# EAGLE schematic XOR gate (EAGLE 6.5.0)
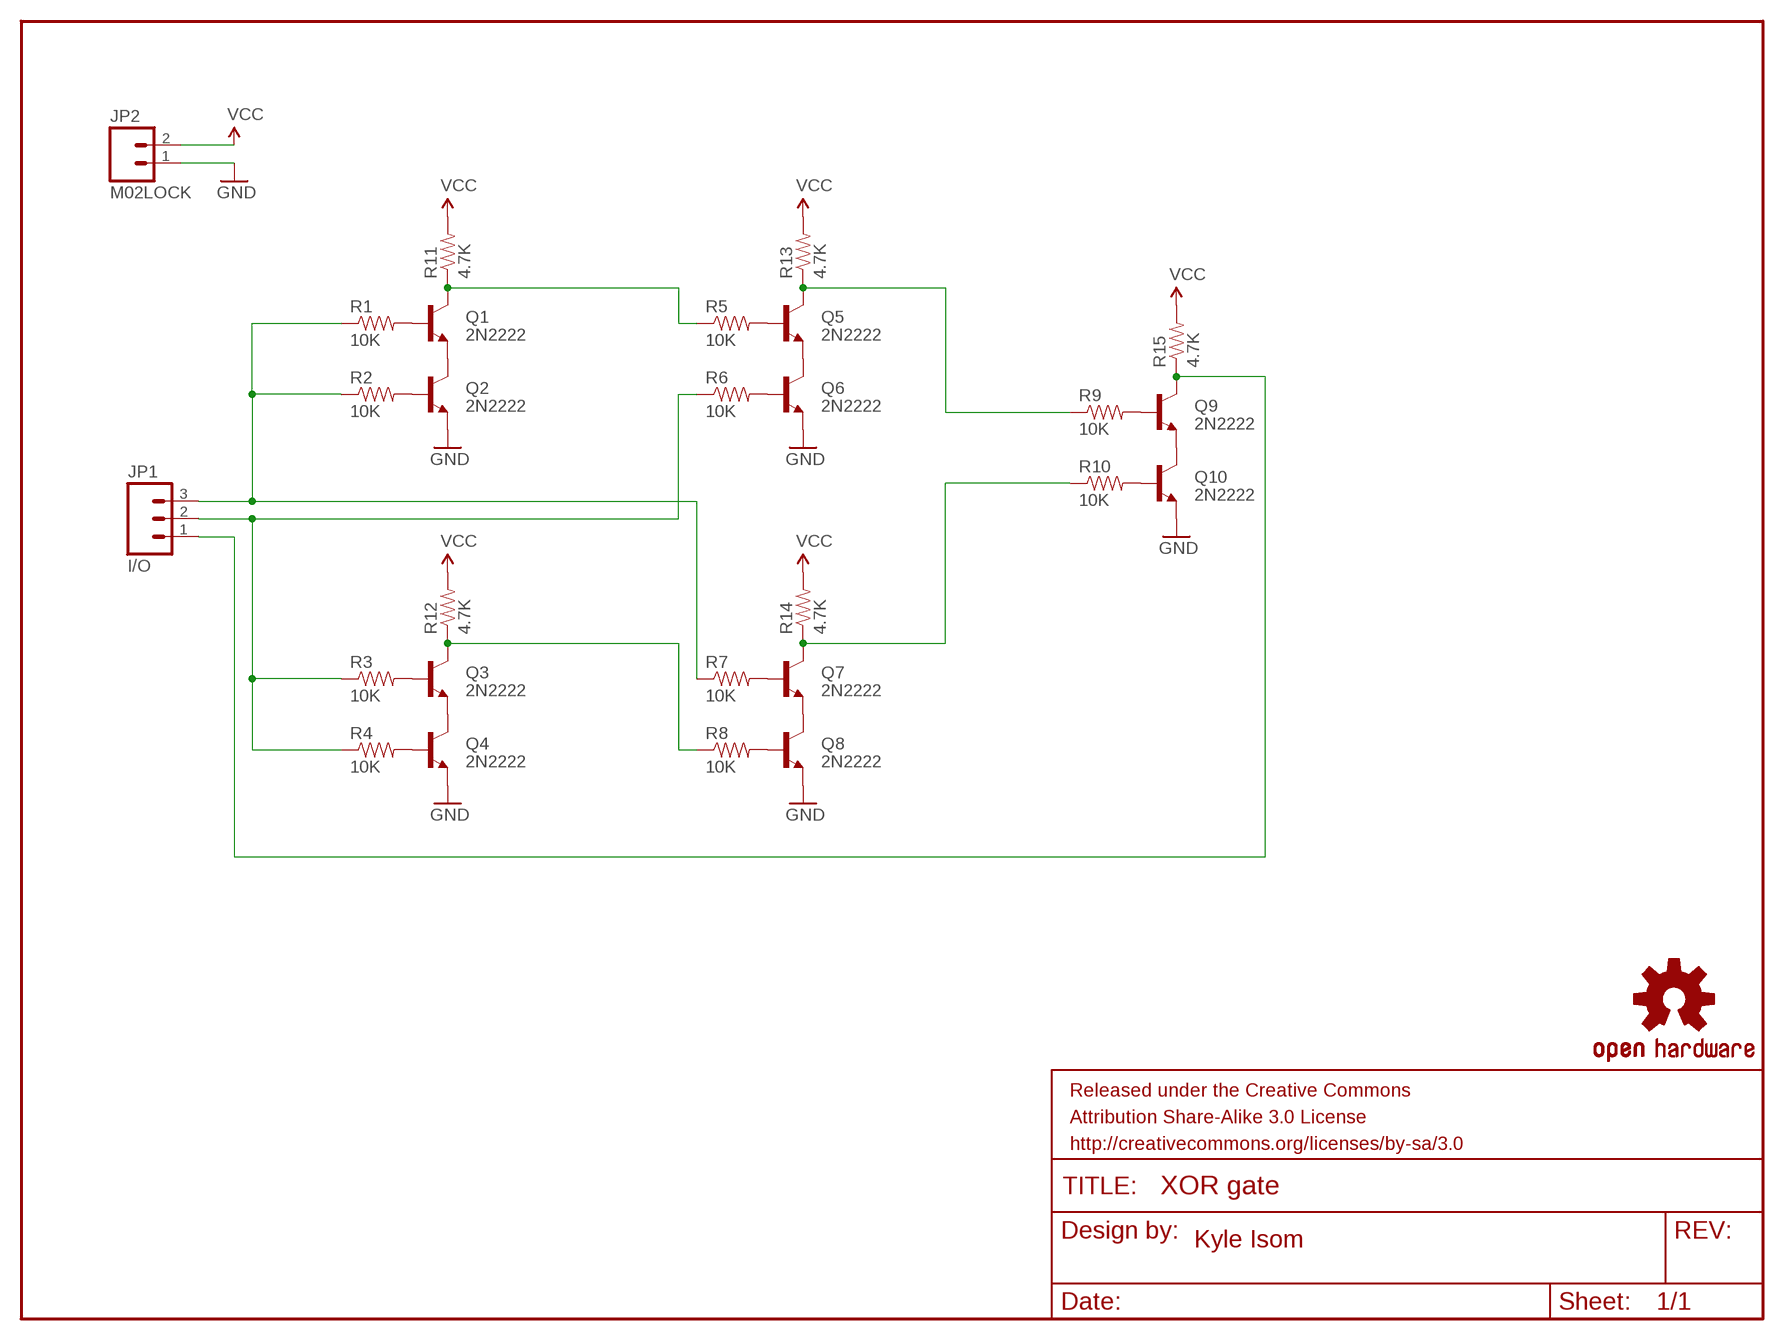
[diagram p0: schematic, sheet 1]

## Parts
FRAME1  FRAME-LETTER  [CREATIVE_COMMONS]
JP1  I/O  M03LOCK  [1X03_LOCK]
JP2  M02LOCK  [1X02_LOCK]
LOGO1  OSHW-LOGOS  [OSHW-LOGO-S]
Q1  2N2222  TRANSISTOR_NPNTO-92-AMMO  [TO-92-AMMO]
Q2  2N2222  TRANSISTOR_NPNTO-92-AMMO  [TO-92-AMMO]
Q3  2N2222  TRANSISTOR_NPNTO-92-AMMO  [TO-92-AMMO]
Q4  2N2222  TRANSISTOR_NPNTO-92-AMMO  [TO-92-AMMO]
Q5  2N2222  TRANSISTOR_NPNTO-92-AMMO  [TO-92-AMMO]
Q6  2N2222  TRANSISTOR_NPNTO-92-AMMO  [TO-92-AMMO]
Q7  2N2222  TRANSISTOR_NPNTO-92-AMMO  [TO-92-AMMO]
Q8  2N2222  TRANSISTOR_NPNTO-92-AMMO  [TO-92-AMMO]
Q9  2N2222  TRANSISTOR_NPNTO-92-AMMO  [TO-92-AMMO]
Q10  2N2222  TRANSISTOR_NPNTO-92-AMMO  [TO-92-AMMO]
R1  10K  RESISTORPTH-1/4W  [AXIAL-0.4]
R2  10K  RESISTORPTH-1/4W  [AXIAL-0.4]
R3  10K  RESISTORPTH-1/4W  [AXIAL-0.4]
R4  10K  RESISTORPTH-1/4W  [AXIAL-0.4]
R5  10K  RESISTORPTH-1/4W  [AXIAL-0.4]
R6  10K  RESISTORPTH-1/4W  [AXIAL-0.4]
R7  10K  RESISTORPTH-1/4W  [AXIAL-0.4]
R8  10K  RESISTORPTH-1/4W  [AXIAL-0.4]
R9  10K  RESISTORPTH-1/4W  [AXIAL-0.4]
R10  10K  RESISTORPTH-1/4W  [AXIAL-0.4]
R11  4.7K  RESISTORPTH-1/4W  [AXIAL-0.4]
R12  4.7K  RESISTORPTH-1/4W  [AXIAL-0.4]
R13  4.7K  RESISTORPTH-1/4W  [AXIAL-0.4]
R14  4.7K  RESISTORPTH-1/4W  [AXIAL-0.4]
R15  4.7K  RESISTORPTH-1/4W  [AXIAL-0.4]

## Nets
GND: JP2.1 Q2.1(E) Q4.1(E) Q6.1(E) Q8.1(E) Q10.1(E)
N$1: Q1.2(B) R1.P$2
N$2: Q2.2(B) R2.P$2
N$3: Q3.2(B) R3.P$2
N$4: Q4.2(B) R4.P$2
N$5: Q5.2(B) R5.P$2
N$6: Q6.2(B) R6.P$2
N$7: Q7.2(B) R7.P$2
N$8: Q8.2(B) R8.P$2
N$9: Q9.2(B) R9.P$2
N$10: Q10.2(B) R10.P$2
N$11: Q1.3(C) R5.P$1 R11.P$1
N$12: Q3.3(C) R8.P$1 R12.P$1
N$13: Q5.3(C) R9.P$1 R13.P$1
N$14: Q7.3(C) R10.P$1 R14.P$1
N$15: JP1.1 Q9.3(C) R15.P$1
N$16: Q1.1(E) Q2.3(C)
N$17: Q5.1(E) Q6.3(C)
N$18: Q3.1(E) Q4.3(C)
N$19: Q7.1(E) Q8.3(C)
N$20: Q9.1(E) Q10.3(C)
N$21: JP1.3 R1.P$1 R2.P$1 R7.P$1
N$22: JP1.2 R3.P$1 R4.P$1 R6.P$1
VCC: JP2.2 R11.P$2 R12.P$2 R13.P$2 R14.P$2 R15.P$2

## Notes on the sheet
- Kyle Isom

## Library data of the parts
FRAME1 = SparkFun-Aesthetics:FRAME-LETTER: Schematic Frame Standard 8.5x11 US Letter frame
JP1 = SparkFun-Connectors:M03: Header 3 Standard 3-pin 0.1" header. Use with straight break away headers (SKU : PRT-00116), right angle break away headers (PRT-00553), swiss pins (PRT-00743), machine pins (PRT-00117), and female headers (PRT-00115). Molex polarized connector foot print use with SKU : PRT-08232 with associated crimp pins and housings.
JP2 = SparkFun-Connectors:M02: Standard 2-pin 0.1" header. Use with - straight break away headers ( PRT-00116) - right angle break away headers (PRT-00553) - swiss pins (PRT-00743) - machine pins (PRT-00117) - female headers (PRT-00115) Molex polarized connector foot print use with: PRT-08233 with associated crimp pins and housings. 2.54_SCREWTERM for use with PRT-10571. 3.5mm Screw Terminal footprints for PRT-08084 5mm Screw Terminal footprints for use with PRT-08433
LOGO1 = SparkFun-Aesthetics:OSHW-LOGO: Open Source Hardware Logo This logo indicates the piece of hardware it is found on incorporates a OSHW license and/or adheres to the definition of open source hardware found here: http://freedomdefined.org/OSHW
Q1-Q10 = SparkFun-DiscreteSemi:TRANSISTOR_NPN: Generic NPN BJT MMBT2222A - TRANS-08049 (SOT-23, 1A 40V) MPSA42 - TRANS-09116 (SOT-23, 500mA 300V) MMBT5088LT1G - TRANS-11160 (SOT-23, 50 mA 30V)
R1-R15 = SparkFun-Passives:RESISTOR: Resistor Basic schematic elements and footprints for 0603, 1206, and PTH resistors.